# Altium project fNIRS_ECU.PrjPcb (part 1 of 3)
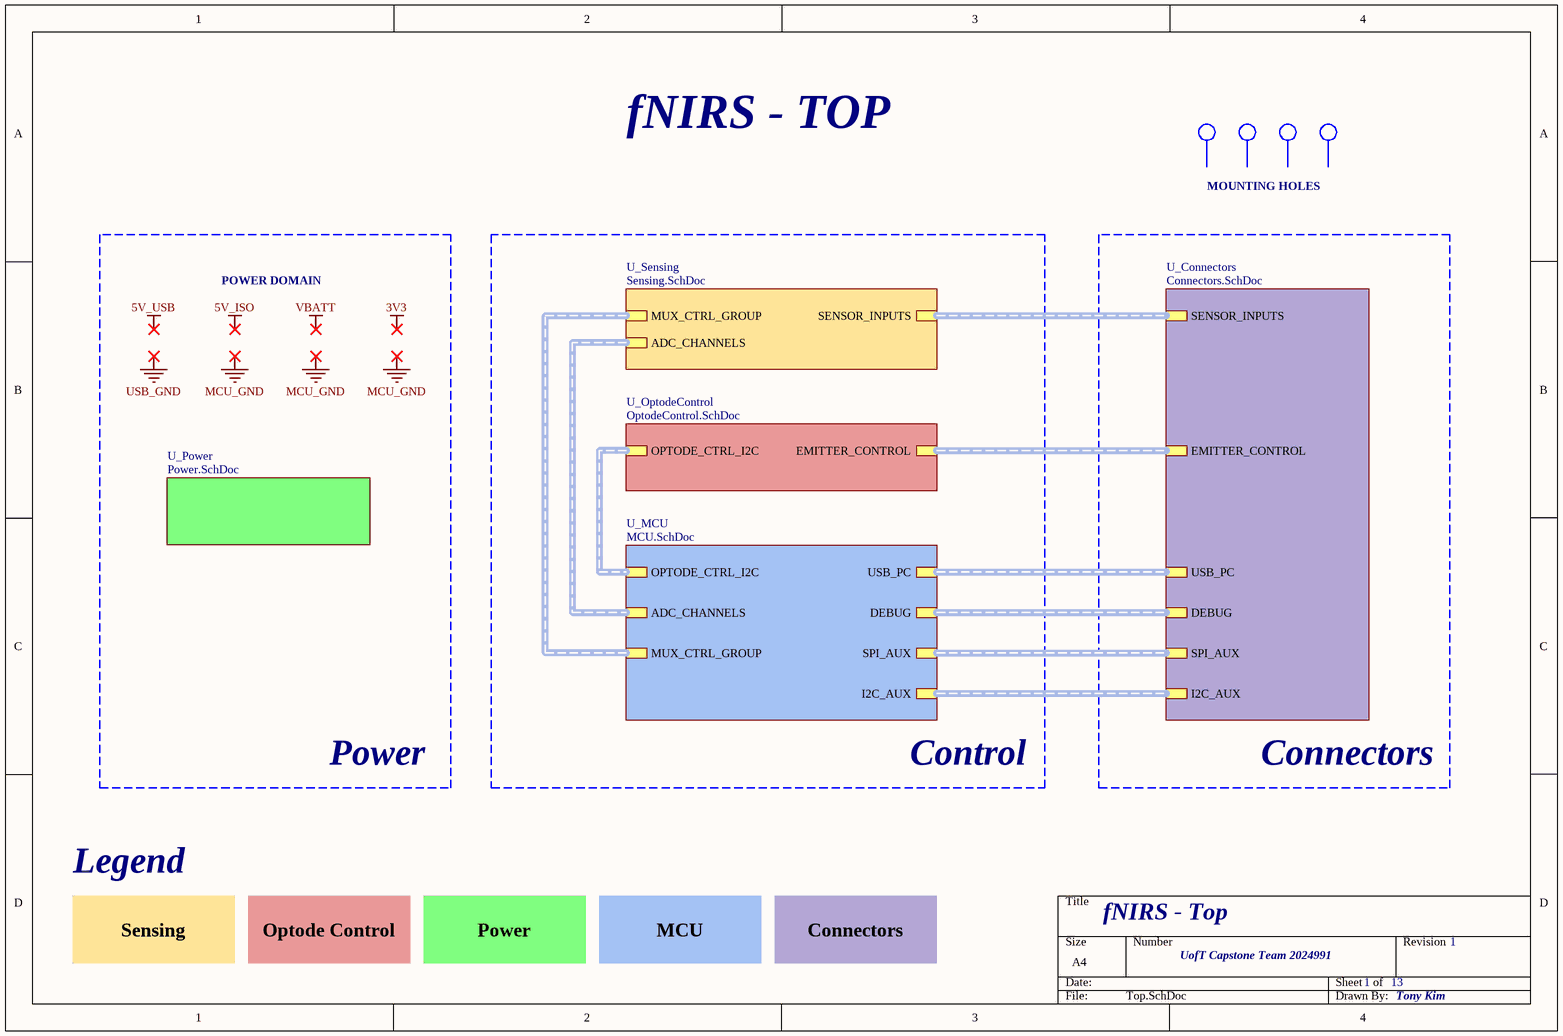
[diagram p0: Top.SchDoc]
13 sheets, 194 parts. Net scope: hierarchical (ports join the sheet entries above them; power ports are global).
Board file: fNIRS_PCB.PcbDoc
Sheets:
  Top.SchDoc
    U_OptodeControl = OptodeControl.SchDoc
    U_Sensing = Sensing.SchDoc
      U_AnalogMux = AnalogMux.SchDoc
      U_AnalogMux = AnalogMux.SchDoc
      U_AnalogMux = AnalogMux.SchDoc
      U_AnalogMux = AnalogMux.SchDoc
      U_AnalogMux = AnalogMux.SchDoc
      U_AnalogMux = AnalogMux.SchDoc
      U_AnalogMux = AnalogMux.SchDoc
      U_AnalogMux = AnalogMux.SchDoc
      U_Buffer = Buffer.SchDoc
      U_Buffer = Buffer.SchDoc
      U_Buffer = Buffer.SchDoc
      U_TemperatureSense = TemperatureSense.SchDoc
    U_Power = Power.SchDoc
    U_MCU = MCU.SchDoc
      U_GPIO_Expander = GPIO_Expander.SchDoc
      U_GPIO_Expander = GPIO_Expander.SchDoc
      U_SD_Card = SD_Card.SchDoc
      U_USBInterface = USBInterface.SchDoc
    U_Connectors = Connectors.SchDoc
      U_OptodeConnectors = OptodeConnectors.SchDoc

## Sheet Top.SchDoc: fNIRS - Top
size A4; CompanyName: UofT Capstone Team 2024991; DrawnBy: Tony Kim; Revision: 1; SheetNumber: 1; SheetTotal: 13

### Parts
MH1  M3 Mounting Hole  [New footprint 1]  (value not drawn)
MH2  M3 Mounting Hole  [New footprint 1]  (value not drawn)
MH3  M3 Mounting Hole  [New footprint 1]  (value not drawn)
MH4  M3 Mounting Hole  [New footprint 1]  (value not drawn)

### Sub-sheets
U_Connectors = Connectors.SchDoc: USB_PC (harness USB_PC), EMITTER_CONTROL (harness EMITTER_CONTROL), SENSOR_INPUTS (harness SENSOR_INPUTS), DEBUG (harness DEBUG), SPI_AUX (harness SPI_AUX), I2C_AUX (harness SPI_AUX)
U_MCU = MCU.SchDoc: ADC_CHANNELS (harness ADC_CHANNELS), DEBUG (harness DEBUG), OPTODE_CTRL_I2C (harness OPTODE_CTRL_I2C), MUX_CTRL_GROUP (harness MUX_SEL_GPIOS), SPI_AUX (harness SPI_AUX), USB_PC (harness USB_PC), I2C_AUX (harness SPI_AUX)
U_OptodeControl = OptodeControl.SchDoc: EMITTER_CONTROL (harness EMITTER_CONTROL), OPTODE_CTRL_I2C (harness OPTODE_CTRL_I2C)
U_Power = Power.SchDoc: no entries
U_Sensing = Sensing.SchDoc: SENSOR_INPUTS (harness SENSOR_INPUTS), MUX_CTRL_GROUP (harness MUX_CTRL_GROUP), ADC_CHANNELS (harness ADC_CHANNELS)

### Buses and harness runs
harness sheet U_Connectors/DEBUG = sheet U_MCU/DEBUG
harness sheet U_Connectors/EMITTER_CONTROL = sheet U_OptodeControl/EMITTER_CONTROL
harness sheet U_Connectors/I2C_AUX = sheet U_MCU/I2C_AUX
harness sheet U_Connectors/SENSOR_INPUTS = sheet U_Sensing/SENSOR_INPUTS
harness sheet U_Connectors/SPI_AUX = sheet U_MCU/SPI_AUX
harness sheet U_Connectors/USB_PC = sheet U_MCU/USB_PC
harness sheet U_MCU/ADC_CHANNELS = sheet U_Sensing/ADC_CHANNELS
harness sheet U_MCU/MUX_CTRL_GROUP = sheet U_Sensing/MUX_CTRL_GROUP
harness sheet U_MCU/OPTODE_CTRL_I2C = sheet U_OptodeControl/OPTODE_CTRL_I2C

### Notes on the sheet
- fNIRS - TOP
- MOUNTING HOLES
- POWER DOMAIN
- Power
- Control
- Connectors
- Legend
- Sensing
- Optode Control
- MCU
- Labels drawn without touching a wire or pin: 3V3, 5V_ISO, 5V_USB, MCU_GND, USB_GND, VBATT

### Library data of the parts
MH1-MH4 = CMP-004-0008-2

## Sheet OptodeControl.SchDoc: fNIRS - Optode Control
size A4; CompanyName: UofT Capstone Team 2024991; DrawnBy: Tony Kim; Revision: 1; SheetNumber: 7; SheetTotal: 13
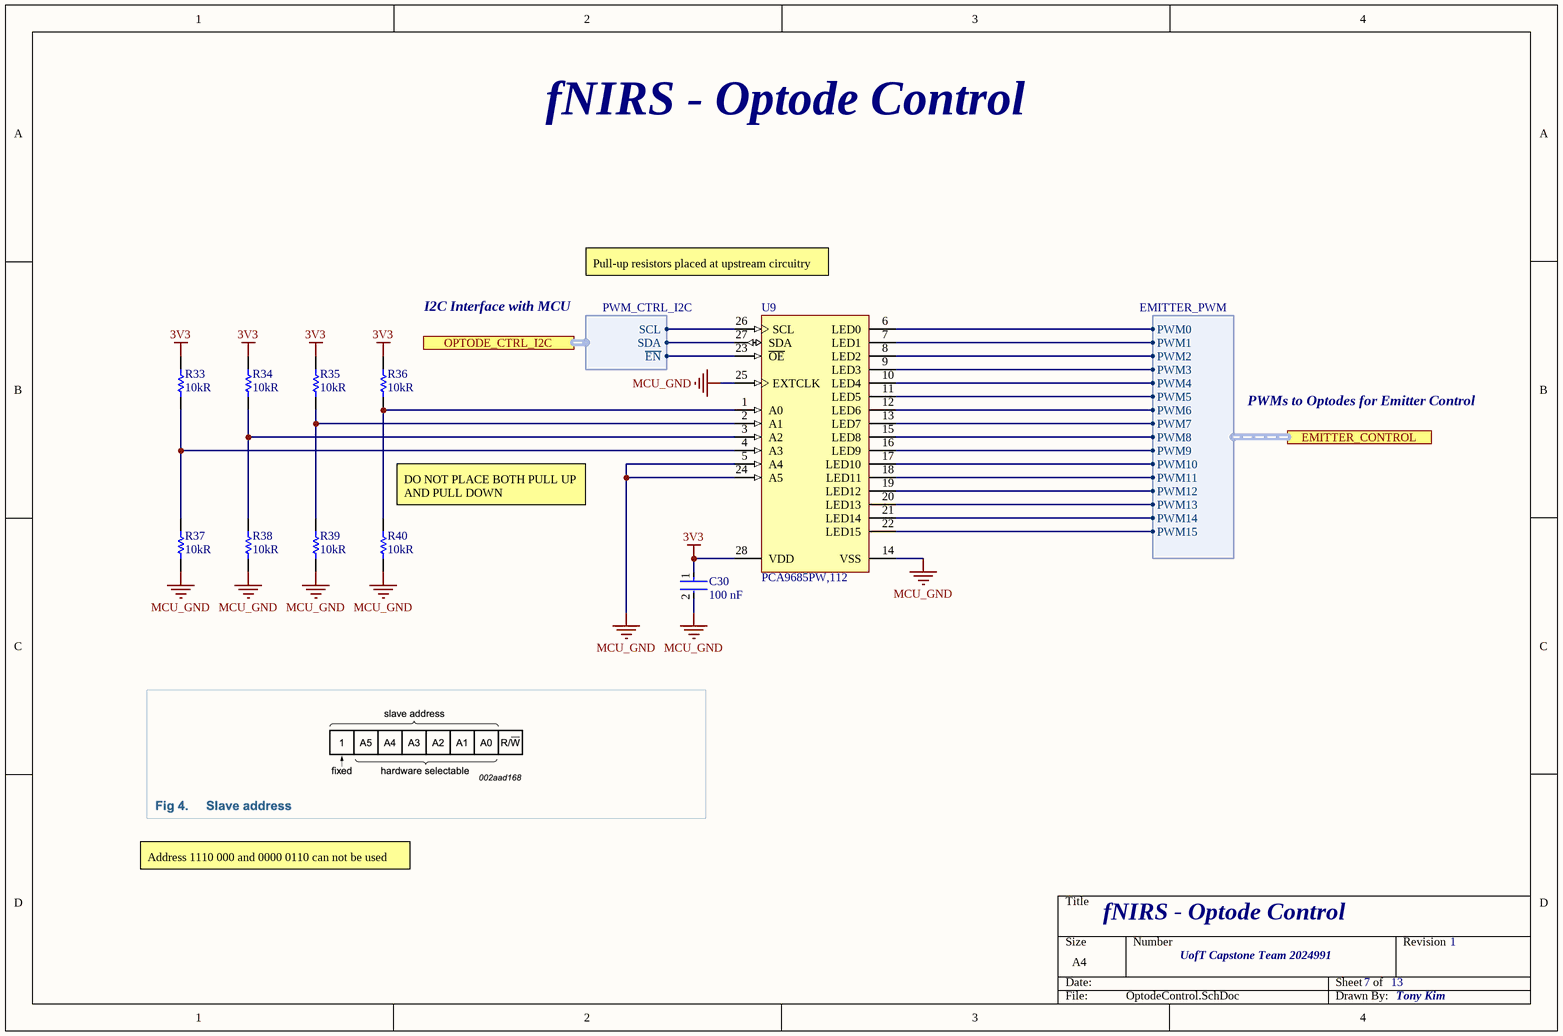
[diagram p1: OptodeControl.SchDoc]

### Parts
C30  Capacitance: 100 nF  [FP-CC0603-DA-MFG]  (hidden comment: CC0603KRX7R7BB104)
R33  Resistance: 10kR  [RESC1609X50X30NL8T20]  (hidden comment: CRCW060310K0FKEA)  (no BOM)
R34  Resistance: 10kR  [RESC1609X50X30NL8T20]  (hidden comment: CRCW060310K0FKEA)  (no BOM)
R35  Resistance: 10kR  [RESC1609X50X30NL8T20]  (hidden comment: CRCW060310K0FKEA)  (no BOM)
R36  Resistance: 10kR  [RESC1609X50X30NL8T20]  (hidden comment: CRCW060310K0FKEA)  (no BOM)
R37  Resistance: 10kR  [RESC1609X50X30NL8T20]  (hidden comment: CRCW060310K0FKEA)  (no BOM)
R38  Resistance: 10kR  [RESC1609X50X30NL8T20]  (hidden comment: CRCW060310K0FKEA)  (no BOM)
R39  Resistance: 10kR  [RESC1609X50X30NL8T20]  (hidden comment: CRCW060310K0FKEA)  (no BOM)
R40  Resistance: 10kR  [RESC1609X50X30NL8T20]  (hidden comment: CRCW060310K0FKEA)  (no BOM)
U9  PCA9685PW,112  [SOT361-1_V]

### Ports
EMITTER_CONTROL (harness EMITTER_PWM, see Top[3B], Connectors[7B]), OPTODE_CTRL_I2C (harness PWM_CTRL_I2C, see Top[2B], MCU[8C])

### Harnesses
PWM_CTRL_I2C: SCL, SDA, ~{EN}
EMITTER_PWM: PWM0, PWM1, PWM2, PWM3, PWM4, PWM5, PWM6, PWM7, PWM8, PWM9, PWM10, PWM11, PWM12, PWM13, PWM14, PWM15

### Nets
3V3: C30.1 R33.2 R34.2 R35.2 R36.2 U9.28(VDD)
MCU_GND: C30.2 R37.1 R38.1 R39.1 R40.1 U9.5(A4) U9.14(VSS) U9.24(A5) U9.25(EXTCLK)
I2C2_SCL: U9.26(SCL) ; port OPTODE_CTRL_I2C.SCL
I2C2_SDA: U9.27(SDA) ; port OPTODE_CTRL_I2C.SDA
PWM0: U9.6(LED0) ; port EMITTER_CONTROL.PWM0
PWM1: U9.7(LED1) ; port EMITTER_CONTROL.PWM1
PWM2: U9.8(LED2) ; port EMITTER_CONTROL.PWM2
PWM3: U9.9(LED3) ; port EMITTER_CONTROL.PWM3
PWM4: U9.10(LED4) ; port EMITTER_CONTROL.PWM4
PWM5: U9.11(LED5) ; port EMITTER_CONTROL.PWM5
PWM6: U9.12(LED6) ; port EMITTER_CONTROL.PWM6
PWM7: U9.13(LED7) ; port EMITTER_CONTROL.PWM7
PWM8: U9.15(LED8) ; port EMITTER_CONTROL.PWM8
PWM9: U9.16(LED9) ; port EMITTER_CONTROL.PWM9
PWM10: U9.17(LED10) ; port EMITTER_CONTROL.PWM10
PWM11: U9.18(LED11) ; port EMITTER_CONTROL.PWM11
PWM12: U9.19(LED12) ; port EMITTER_CONTROL.PWM12
PWM13: U9.20(LED13) ; port EMITTER_CONTROL.PWM13
PWM14: U9.21(LED14) ; port EMITTER_CONTROL.PWM14
PWM15: U9.22(LED15) ; port EMITTER_CONTROL.PWM15
PWM_CTRL_EN1: U9.23(~{OE}) ; port OPTODE_CTRL_I2C.~{EN}
NetR33_1: R33.1 R37.2 U9.4(A3)
NetR34_1: R34.1 R38.2 U9.3(A2)
NetR35_1: R35.1 R39.2 U9.2(A1)
NetR36_1: R36.1 R40.2 U9.1(A0)

### Notes on the sheet
- fNIRS - Optode Control
- I2C Interface with MCU
- Pull-up resistors placed at upstream circuitry
- PWMs to Optodes for Emitter Control
- (near R40) DO NOT PLACE BOTH PULL UP AND PULL DOWN
- Address 1110 000 and 0000 0110 can not be used

### Library data of the parts
C30 = CMP-2000-05002-2: CAP CER 0.1UF 16V X7R 0603; Manufacturer: YAGEO; Tolerance: 0.1; Value: 100 nF; Temperature Coefficient: 15%; Material: Ceramic; Voltage Rating: 16 V; Package: CC0603-DA; ComponentLink2Description: Datasheet; Octopart: https://octopart.com/cc0603krx7r7bb104-yageo-192941; Temperature Range High: +125°C; Digikey Description: CAP CER 0.1UF 16V X7R 0603; Voltage: 16 V; Device Class L2: Capacitors; Height: 0.9mm; Temperature: -55°C to +125°C; Manufacturer Part Number: CC0603KRX7R7BB104; Device Class L1: Passive Components; Device Class L3: Ceramic Capacitors; ComponentLink2URL: http://www.yageo.com/documents/recent/UPY-GPHC_X7R_6.3V-to-50V_18.pdf; Footprint Url: http://www.yageo.com/exep/pages/download/literatures/UPY-C_GEN_24.pdf; RoHS: TRUE; Temperature Range Low: -55°C; Temperature Characteristic: X7R; Lead Free: Yes; Category: Cap; Mouser Description: Multilayer Ceramic Capacitor, CC Series, 0.1 - F, - 10%, X7R, 16 V, 0603 [1608 Metric]; Automotive: No
R33-R40 = CMP-1666-00005-4: Chip Resistor, 10 KOhm, +/- 1%, 100 mW, -55 to 155 degC, 0603 (1608 Metric), RoHS, Tape and Reel; Manufacturer: Vishay Semiconductor; Voltage Rating: 75 V; Max Operating Temperature: 155 degC; PackageDescription: 2-Pin Surface Mount Device, Body 1.575 x 0.85 mm; ComponentLink1Description: Manufacturer URL; RoHSCompliant: true; PackageReference: 0603; REACH SVHC: Unknown; Length: 1.55 mm; DatasheetVersion: 06/2012; Packaging: Tape and Reel; Min Operating Temperature: -55 degC; Mounting Technology: Surface Mount; ComponentLink2URL: https://datasheet.ciiva.com/11809/0900766b80d98afc-11809037.pdf; Height: 0.45 mm; ComponentLink2Description: Datasheet; Package Quantity: 5000; ComponentLink1URL: http://www.vishay.com/
U9 = CMP-1595-00004-2: 16-Channel, 12-Bit PWM Fm+ I2C-Bus LED Controller, 2.3 to 5.5 V, -40 to 85 degC, 28-Pin TSSOP (SOT361-1), RoHS, Tape and Reel; Supply Current Max: 10 mA; Supply Voltage Min: 2.3 V; Supply Voltage Max: 5.5 V; Frequency: 25000000 Hz; Temperature Min: -40 degC; PackageDescription: 28-Pin Small Outline Package, Body 9.7 x 4.4 mm, Pitch 0.65 mm; RoHS: TRUE; ComponentLink1Description: Manufacturer URL; Code_JEDEC: MO-153; PartNumber: PCA9685; ComponentLink2URL: http://www.nxp.com/documents/data_sheet/PCA9685.pdf; Packing: Tape and Reel; ComponentLink1URL: http://www.nxp.com/; ComponentLink3Description: Package Specification; ComponentLink2Description: Datasheet; ComponentLink3URL: http://www.nxp.com/documents/outline_drawing/sot361-1_po.pdf; DatasheetVersion: Rev. 4; Temperature Max: 85 degC; PackageVersion: 02/2003; Mounting Technology: Surface Mount

## Sheet Sensing.SchDoc: fNIRS - Sensing
size A3; CompanyName: UofT Capstone Team 2024991; DrawnBy: Tony Kim; Revision: 1; SheetNumber: 8; SheetTotal: 13
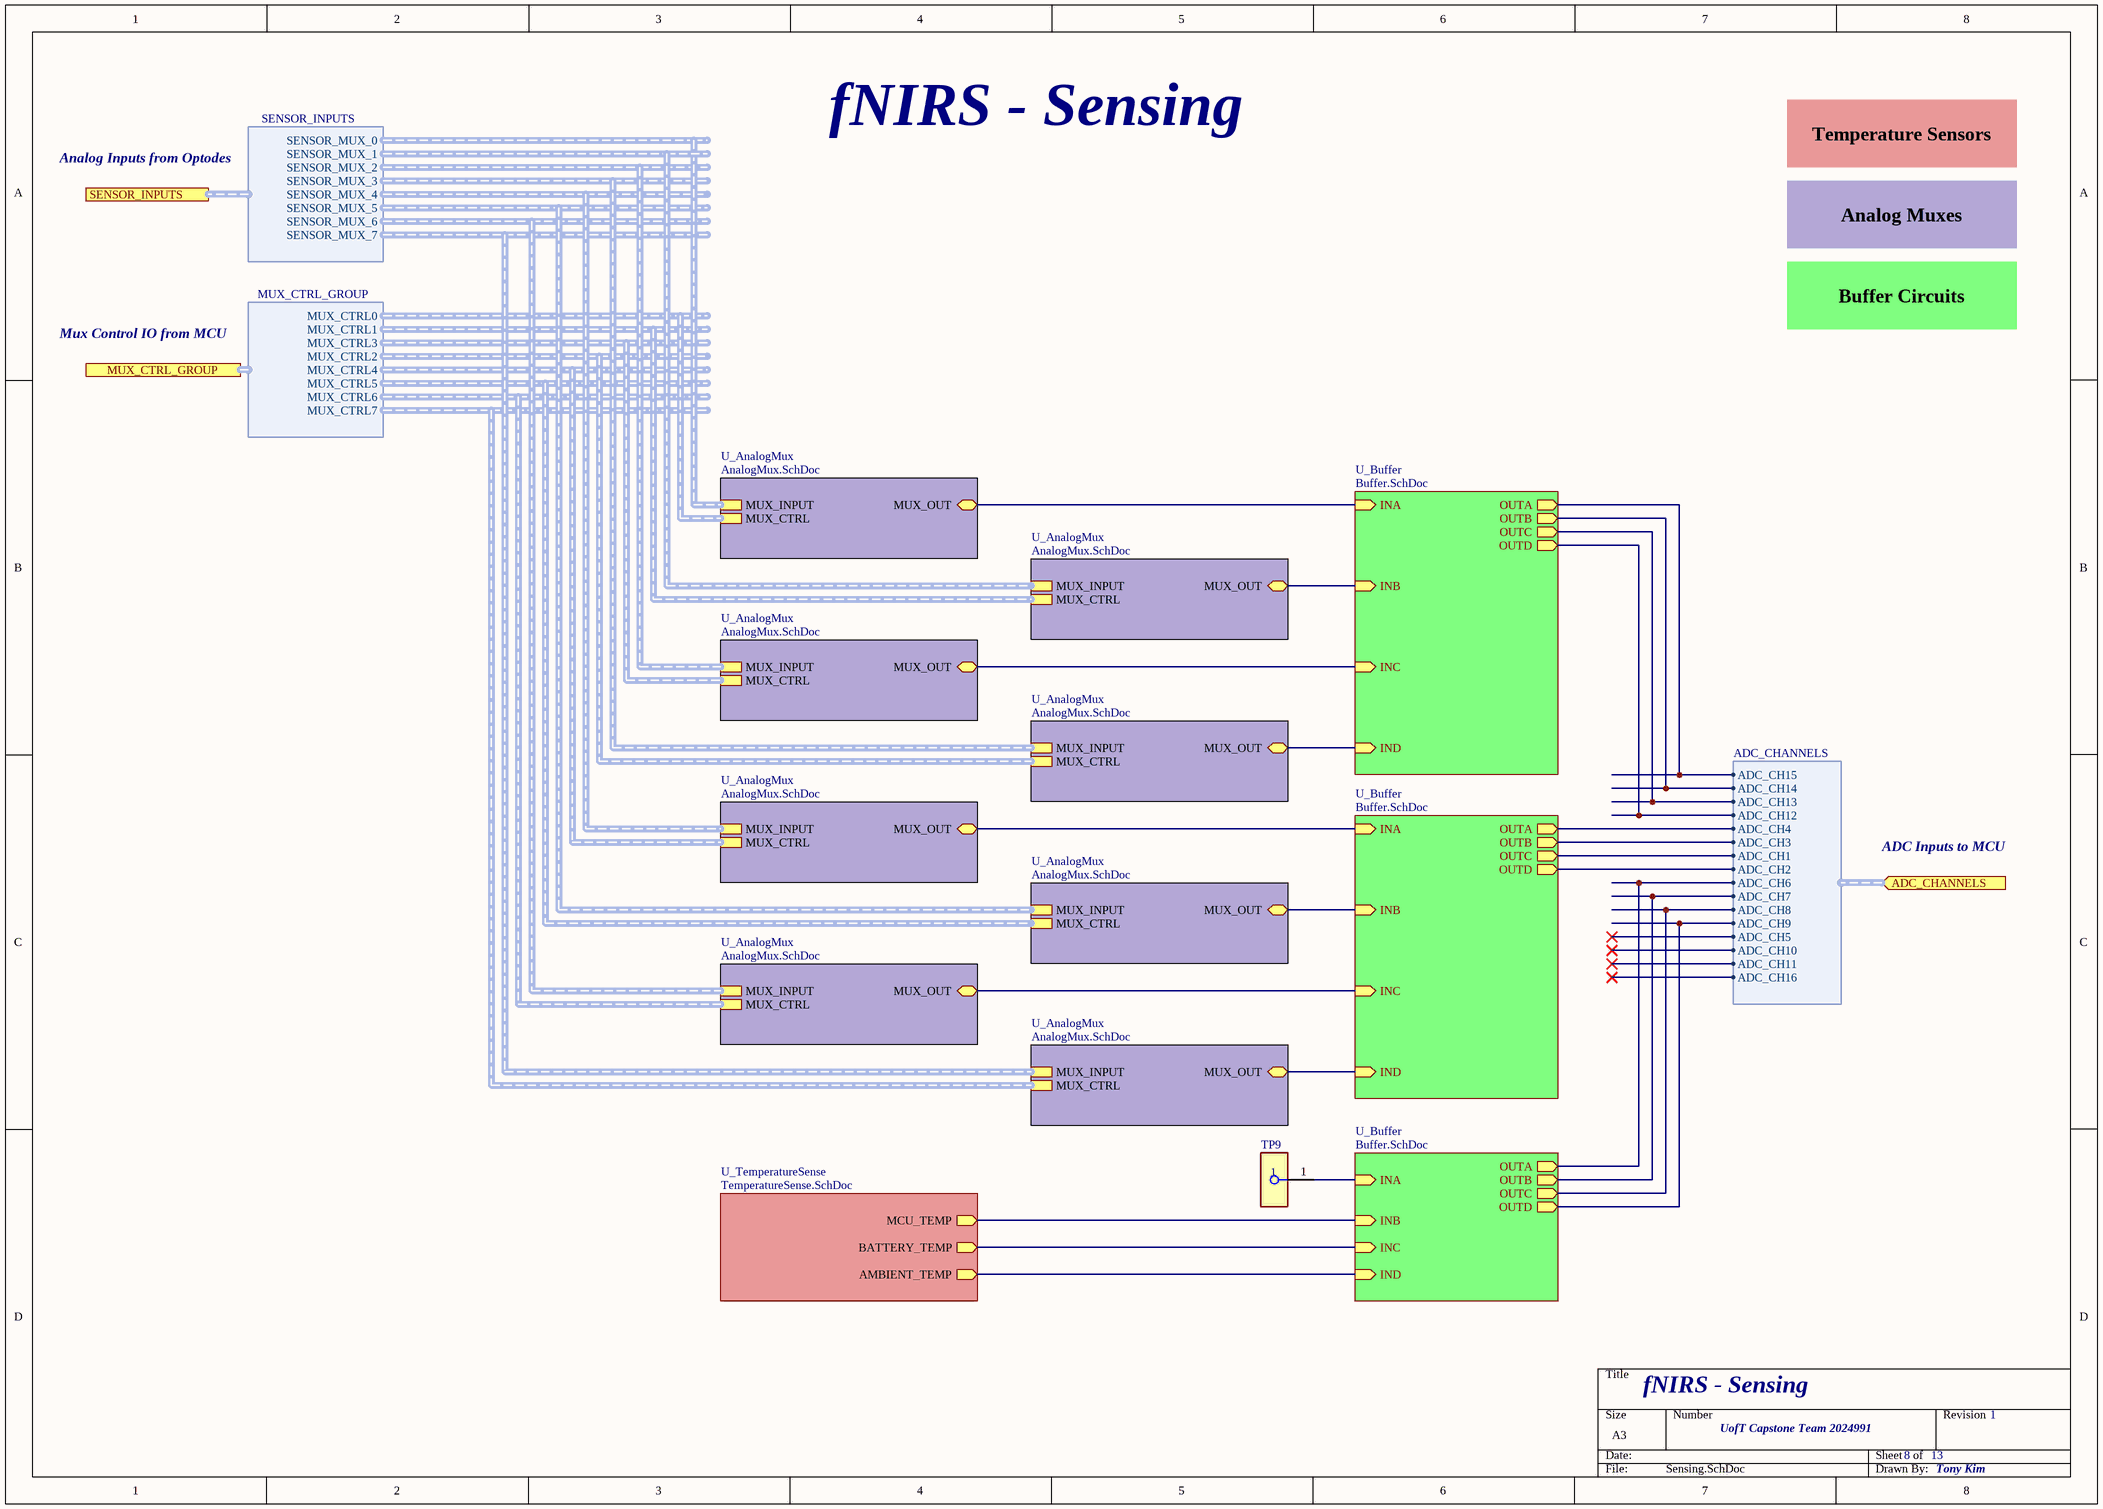
[diagram p2: Sensing.SchDoc]

### Parts
TP9  S2761-46R  [FP-S2761-46R-MFG]  (value not drawn)

### Sub-sheets
U_AnalogMux = AnalogMux.SchDoc: MUX_INPUT (harness SENSOR_INPUT), MUX_CTRL (harness MUX_CTRL), MUX_OUT (bidir)
U_AnalogMux = AnalogMux.SchDoc: MUX_INPUT (harness SENSOR_INPUT), MUX_CTRL (harness MUX_CTRL), MUX_OUT (bidir)
U_AnalogMux = AnalogMux.SchDoc: MUX_INPUT (harness SENSOR_INPUT), MUX_CTRL (harness MUX_CTRL), MUX_OUT (bidir)
U_AnalogMux = AnalogMux.SchDoc: MUX_INPUT (harness SENSOR_INPUT), MUX_CTRL (harness MUX_CTRL), MUX_OUT (bidir)
U_AnalogMux = AnalogMux.SchDoc: MUX_INPUT (harness SENSOR_INPUT), MUX_CTRL (harness MUX_CTRL), MUX_OUT (bidir)
U_AnalogMux = AnalogMux.SchDoc: MUX_INPUT (harness SENSOR_INPUT), MUX_CTRL (harness MUX_CTRL), MUX_OUT (bidir)
U_AnalogMux = AnalogMux.SchDoc: MUX_INPUT (harness SENSOR_INPUT), MUX_CTRL (harness MUX_CTRL), MUX_OUT (bidir)
U_AnalogMux = AnalogMux.SchDoc: MUX_INPUT (harness SENSOR_INPUT), MUX_CTRL (harness MUX_CTRL), MUX_OUT (bidir)
U_Buffer = Buffer.SchDoc: OUTA (out), OUTB (out), OUTC (out), OUTD (out), INA (in), INB (in), INC (in), IND (in)
U_Buffer = Buffer.SchDoc: OUTA (out), OUTB (out), OUTC (out), OUTD (out), INA (in), INB (in), INC (in), IND (in)
U_Buffer = Buffer.SchDoc: OUTA (out), OUTB (out), OUTC (out), OUTD (out), INA (in), INB (in), INC (in), IND (in)
U_TemperatureSense = TemperatureSense.SchDoc: MCU_TEMP (out), AMBIENT_TEMP (out), BATTERY_TEMP (out)

### Ports
ADC_CHANNELS (in, harness ADC_CHANNELS, see Top[2B], MCU[1C]), MUX_CTRL_GROUP (harness MUX_CTRL_GROUP, see Top[2B], MCU[8B]), SENSOR_INPUTS (harness SENSOR_INPUTS, see Top[3B], Connectors[1B])

### Harnesses
SENSOR_INPUTS: SENSOR_MUX_0, SENSOR_MUX_1, SENSOR_MUX_2, SENSOR_MUX_3, SENSOR_MUX_4, SENSOR_MUX_5, SENSOR_MUX_6, SENSOR_MUX_7
MUX_CTRL_GROUP: MUX_CTRL0, MUX_CTRL1, MUX_CTRL3, MUX_CTRL2, MUX_CTRL4, MUX_CTRL5, MUX_CTRL6, MUX_CTRL7
ADC_CHANNELS: ADC_CH1, ADC_CH2, ADC_CH3, ADC_CH4, ADC_CH5, ADC_CH6, ADC_CH7, ADC_CH8, ADC_CH9, ADC_CH10, ADC_CH11, ADC_CH12, ADC_CH13, ADC_CH14, ADC_CH15, ADC_CH16

### Nets
ADC12_IN6: sheet U_Buffer/OUTA, port ADC_CHANNELS.ADC_CH6
ADC12_IN7: sheet U_Buffer/OUTB, port ADC_CHANNELS.ADC_CH7
ADC12_IN8: sheet U_Buffer/OUTC, port ADC_CHANNELS.ADC_CH8
ADC12_IN9: sheet U_Buffer/OUTD, port ADC_CHANNELS.ADC_CH9
ADC12_IN12: sheet U_Buffer/OUTD, port ADC_CHANNELS.ADC_CH12
ADC12_IN13: sheet U_Buffer/OUTC, port ADC_CHANNELS.ADC_CH13
ADC12_IN14: sheet U_Buffer/OUTB, port ADC_CHANNELS.ADC_CH14
ADC12_IN15: sheet U_Buffer/OUTA, port ADC_CHANNELS.ADC_CH15
ADC123_IN1: sheet U_Buffer/OUTC, port ADC_CHANNELS.ADC_CH1
ADC123_IN2: sheet U_Buffer/OUTD, port ADC_CHANNELS.ADC_CH2
ADC123_IN3: sheet U_Buffer/OUTB, port ADC_CHANNELS.ADC_CH3
ADC123_IN4: sheet U_Buffer/OUTA, port ADC_CHANNELS.ADC_CH4
AMBIENT_TEMP: sheet U_Buffer/IND, sheet U_TemperatureSense/AMBIENT_TEMP
BATTERY_TEMP: sheet U_Buffer/INC, sheet U_TemperatureSense/BATTERY_TEMP
INA: TP9.1 ; sheet U_Buffer/INA
INA: sheet U_AnalogMux/MUX_OUT, sheet U_Buffer/INA  [a separate net that carries the same name]
INA: sheet U_AnalogMux/MUX_OUT, sheet U_Buffer/INA  [a separate net that carries the same name]
INB: sheet U_AnalogMux/MUX_OUT, sheet U_Buffer/INB
INB: sheet U_AnalogMux/MUX_OUT, sheet U_Buffer/INB  [a separate net that carries the same name]
INB: sheet U_Buffer/INB, sheet U_TemperatureSense/MCU_TEMP  [a separate net that carries the same name]
INC: sheet U_AnalogMux/MUX_OUT, sheet U_Buffer/INC
INC: sheet U_AnalogMux/MUX_OUT, sheet U_Buffer/INC  [a separate net that carries the same name]
IND: sheet U_AnalogMux/MUX_OUT, sheet U_Buffer/IND
IND: sheet U_AnalogMux/MUX_OUT, sheet U_Buffer/IND  [a separate net that carries the same name]

### Notes on the sheet
- Analog Inputs from Optodes
- fNIRS - Sensing
- Temperature Sensors
- Analog Muxes
- Mux Control IO from MCU
- Buffer Circuits
- ADC Inputs to MCU

### Library data of the parts
TP9 = CMP-15817-000011-1: PC TEST POINT NATURAL; Body Material: Brass; Plating: Tin; Material: Copper Alloy; Mount: Surface Mount; Color: Natural; Packaging: Tape and Reel; RoHS Compliant: Yes

## Sheet AnalogMux.SchDoc: fNIRS - Analog Mux
size A4; CompanyName: UofT Capstone Team 2024991; DrawnBy: Tony Kim; Engineer: Tony Kim; Revision: 1; SheetNumber: 9; SheetTotal: 13
Used 8 times, as channels U_Sensing/U_AnalogMux, U_Sensing/U_AnalogMux, U_Sensing/U_AnalogMux, U_Sensing/U_AnalogMux, U_Sensing/U_AnalogMux, U_Sensing/U_AnalogMux, U_Sensing/U_AnalogMux, U_Sensing/U_AnalogMux. Parts and nets are listed once, with the designators drawn on the sheet.
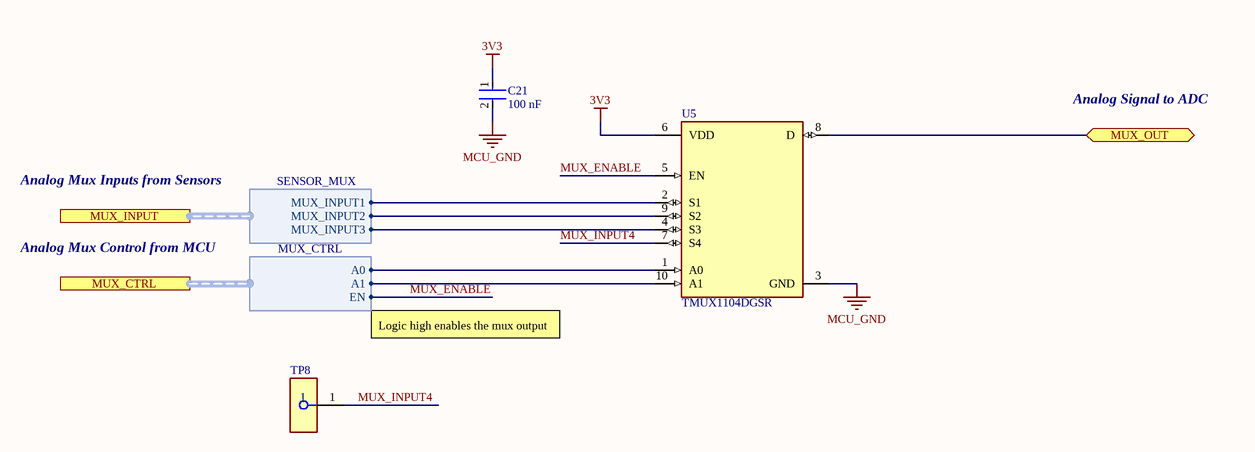
[diagram p3: AnalogMux.SchDoc]

### Parts
C21  Capacitance: 100 nF  [FP-CC0603-DA-MFG]  (hidden comment: CC0603KRX7R7BB104)
TP8  S2761-46R  [FP-S2761-46R-MFG]  (value not drawn)
U5  TMUX1104DGSR  [FP-DGS0010A-MFG]

### Ports
MUX_CTRL (harness MUX_CTRL, see Sensing[3B]), MUX_INPUT (harness SENSOR_MUX, see Sensing[3B]), MUX_OUT (bidir, see Sensing[4B])

### Harnesses
SENSOR_MUX: MUX_INPUT1, MUX_INPUT2, MUX_INPUT3
MUX_CTRL: A0, A1, EN

### Nets
3V3: C21.1 U5.6(VDD)
MCU_GND: C21.2 U5.3(GND)
MUX_ENABLE: U5.5(EN) ; port MUX_CTRL.EN
MUX_INPUT4: TP8.1 U5.7(S4)
MUX_OUT: U5.8(D) ; port MUX_OUT
NetU5_1: U5.1(A0) ; port MUX_CTRL.A0
NetU5_2: U5.2(S1) ; port MUX_INPUT.MUX_INPUT1
NetU5_4: U5.4(S3) ; port MUX_INPUT.MUX_INPUT3
NetU5_9: U5.9(S2) ; port MUX_INPUT.MUX_INPUT2
NetU5_10: U5.10(A1) ; port MUX_CTRL.A1

### Channels
U_Sensing/U_AnalogMux: designators end in _U_Sensing_U_AnalogMux#1; ports MUX_OUT=INA
U_Sensing/U_AnalogMux: designators end in _U_Sensing_U_AnalogMux#2; ports MUX_OUT=INC
U_Sensing/U_AnalogMux: designators end in _U_Sensing_U_AnalogMux#3; ports MUX_OUT=INA
U_Sensing/U_AnalogMux: designators end in _U_Sensing_U_AnalogMux#4; ports MUX_OUT=INC
U_Sensing/U_AnalogMux: designators end in _U_Sensing_U_AnalogMux#5; ports MUX_OUT=INB
U_Sensing/U_AnalogMux: designators end in _U_Sensing_U_AnalogMux#6; ports MUX_OUT=IND
U_Sensing/U_AnalogMux: designators end in _U_Sensing_U_AnalogMux#7; ports MUX_OUT=INB
U_Sensing/U_AnalogMux: designators end in _U_Sensing_U_AnalogMux#8; ports MUX_OUT=IND

### Notes on the sheet
- Analog Signal to ADC
- Analog Mux Inputs from Sensors
- Analog Mux Control from MCU
- Logic high enables the mux output

### Library data of the parts
C21 = CMP-2000-05002-2: as C30 on sheet OptodeControl; Voltage Rating: 16 V; Package: CC0603-DA; ComponentLink2Description: Datasheet; Octopart: https://octopart.com/cc0603krx7r7bb104-yageo-192941; Temperature Range High: +125°C; Digikey Description: CAP CER 0.1UF 16V X7R 0603; Voltage: 16 V; Device Class L2: Capacitors; Height: 0.9mm; Temperature: -55°C to +125°C; Manufacturer Part Number: CC0603KRX7R7BB104; Device Class L1: Passive Components; Device Class L3: Ceramic Capacitors; ComponentLink2URL: http://www.yageo.com/documents/recent/UPY-GPHC_X7R_6.3V-to-50V_18.pdf; Footprint Url: http://www.yageo.com/exep/pages/download/literatures/UPY-C_GEN_24.pdf; RoHS: TRUE; Temperature Range Low: -55°C; Temperature Characteristic: X7R; Lead Free: Yes; Category: Cap; Mouser Description: Multilayer Ceramic Capacitor, CC Series, 0.1 - F, - 10%, X7R, 16 V, 0603 [1608 Metric]; Automotive: No
TP8 = CMP-15817-000011-1: as TP9 on sheet Sensing; Material: Copper Alloy; Mount: Surface Mount; Color: Natural; Packaging: Tape and Reel; RoHS Compliant: Yes
U5 = CMP-04892-000031-2: IC SWITCH SINGLE 10VSSOP; RoHS Compliant: Yes

## Sheet Buffer.SchDoc: fNIRS - Buffer
size A4; CompanyName: UofT Capstone Team 2024991; DrawnBy: Tony Kim; Revision: 1; SheetNumber: 10; SheetTotal: 13
Used 3 times, as channels U_Sensing/U_Buffer, U_Sensing/U_Buffer, U_Sensing/U_Buffer. Parts and nets are listed once, with the designators drawn on the sheet.
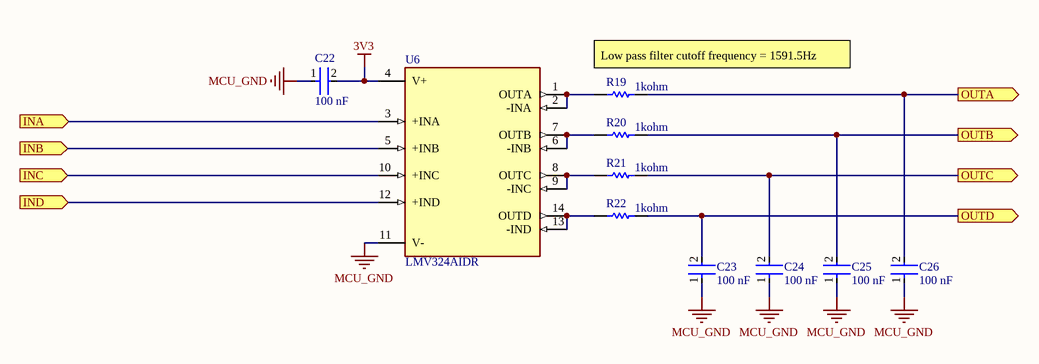
[diagram p4: Buffer.SchDoc]

### Parts
C22  Capacitance: 100 nF  [FP-CC0603-DA-MFG]  (hidden comment: CC0603KRX7R7BB104)
C23  Capacitance: 100 nF  [FP-CC0603-DA-MFG]  (hidden comment: CC0603KRX7R7BB104)
C24  Capacitance: 100 nF  [FP-CC0603-DA-MFG]  (hidden comment: CC0603KRX7R7BB104)
C25  Capacitance: 100 nF  [FP-CC0603-DA-MFG]  (hidden comment: CC0603KRX7R7BB104)
C26  Capacitance: 100 nF  [FP-CC0603-DA-MFG]  (hidden comment: CC0603KRX7R7BB104)
R19  Resistance: 1kohm  [RESC1608X55X25ML10T15]  (hidden comment: RC0603JR-071KL)
R20  Resistance: 1kohm  [RESC1608X55X25ML10T15]  (hidden comment: RC0603JR-071KL)
R21  Resistance: 1kohm  [RESC1608X55X25ML10T15]  (hidden comment: RC0603JR-071KL)
R22  Resistance: 1kohm  [RESC1608X55X25ML10T15]  (hidden comment: RC0603JR-071KL)
U6  LMV324AIDR  [SOIC127P600X175-14N]

### Ports
INA (in, see Sensing[6B]), INB (in, see Sensing[6B]), INC (in, see Sensing[6B]), IND (in, see Sensing[6B]), OUTA (out, see Sensing[6B]), OUTB (out, see Sensing[6B]), OUTC (out, see Sensing[6B]), OUTD (out, see Sensing[6B])

### Nets
3V3: C22.2 U6.4(V+)
MCU_GND: C22.1 C23.1 C24.1 C25.1 C26.1 U6.11(V-)
INA: U6.3(+INA) ; port INA
INB: U6.5(+INB) ; port INB
INC: U6.10(+INC) ; port INC
IND: U6.12(+IND) ; port IND
OUTA: C26.2 R19.2 ; port OUTA
OUTB: C25.2 R20.2 ; port OUTB
OUTC: C24.2 R21.2 ; port OUTC
OUTD: C23.2 R22.2 ; port OUTD
NetR19_1: R19.1 U6.1(OUTA) U6.2(-INA)
NetR20_1: R20.1 U6.6(-INB) U6.7(OUTB)
NetR21_1: R21.1 U6.8(OUTC) U6.9(-INC)
NetR22_1: R22.1 U6.13(-IND) U6.14(OUTD)

### Channels
U_Sensing/U_Buffer: designators end in _U_Sensing_U_Buffer#1; ports INA=INA INB=INB INC=INC IND=IND OUTA=ADC12_IN15 OUTB=ADC12_IN14 OUTC=ADC12_IN13 OUTD=ADC12_IN12
U_Sensing/U_Buffer: designators end in _U_Sensing_U_Buffer#2; ports INA=INA INB=INB INC=INC IND=IND OUTA=ADC123_IN4 OUTB=ADC123_IN3 OUTC=ADC123_IN1 OUTD=ADC123_IN2
U_Sensing/U_Buffer: designators end in _U_Sensing_U_Buffer#3; ports INA=INA INB=INB INC=BATTERY_TEMP IND=AMBIENT_TEMP OUTA=ADC12_IN6 OUTB=ADC12_IN7 OUTC=ADC12_IN8 OUTD=ADC12_IN9

### Notes on the sheet
- (near R19) Low pass filter cutoff frequency = 1591.5Hz

### Library data of the parts
C22-C26 = CMP-2000-05002-2: as C30 on sheet OptodeControl; Voltage Rating: 16 V; Package: CC0603-DA; ComponentLink2Description: Datasheet; Octopart: https://octopart.com/cc0603krx7r7bb104-yageo-192941; Temperature Range High: +125°C; Digikey Description: CAP CER 0.1UF 16V X7R 0603; Voltage: 16 V; Device Class L2: Capacitors; Height: 0.9mm; Temperature: -55°C to +125°C; Manufacturer Part Number: CC0603KRX7R7BB104; Device Class L1: Passive Components; Device Class L3: Ceramic Capacitors; ComponentLink2URL: http://www.yageo.com/documents/recent/UPY-GPHC_X7R_6.3V-to-50V_18.pdf; Footprint Url: http://www.yageo.com/exep/pages/download/literatures/UPY-C_GEN_24.pdf; RoHS: TRUE; Temperature Range Low: -55°C; Temperature Characteristic: X7R; Lead Free: Yes; Category: Cap; Mouser Description: Multilayer Ceramic Capacitor, CC Series, 0.1 - F, - 10%, X7R, 16 V, 0603 [1608 Metric]; Automotive: No
R19-R22 = CMP-2000-05023-1: Chip Resistor, 1 KOhm, +/- 5%, 0.063 W, -55 to 155 degC, 0603 (1608 Metric), RoHS, Tape and Reel; Manufacturer: Yageo; Resistor Case Style: 0603[1608Metric]; Resistor Element Type: ThickFilm; Product Range: RCSeries; SVHC: ToBeAdvised; Voltage Rating: 50V; Temperature Coefficient: ±100ppm/degC; Power Rating: 100mW; Packaging: CutTape; Manufacturer URL: http://www.yageo.com/; Resistance Tolerance: ±5%; Datasheet Version: Rev. 4, 04/2009; MSL: MSL1-Unlimited; Package Description: 2-Pin Surface Mount Device, Body 1.6 x 0.8 mm; Automotive Qualification Standard: -; Package Reference: 603; Datasheet URL: https://datasheet.ciiva.com/2452/pyu-rc0603-51-rohs-l-4-2452848.pdf
U6 = LMV324AIDR: LMV324A, Quad Low-Voltage Rail-to-Rail Output Operational Amplifier 14-SOIC -40 to 125; MF: Texas Instruments; Package: SOIC-14 Texas Instruments; Price: None; MP: LMV324AIDR; Availability: Warning; Value: *; Texas_Instruments-Purchase-URL: https://snapeda.com/shop?store=Texas+Instruments&id=3658521; Mouser-Purchase-URL: https://snapeda.com/shop?store=Mouser&id=3658521; SnapEDA_Link: https://www.snapeda.com/parts/LMV324AIDR/Texas%20Instruments/view-part/3658521/?ref=snap

## Sheet TemperatureSense.SchDoc: fNIRS - Temperature Sense
size A4; CompanyName: UofT Capstone Team 2024991; DrawnBy: Tony Kim; Revision: 1; SheetNumber: 11; SheetTotal: 13
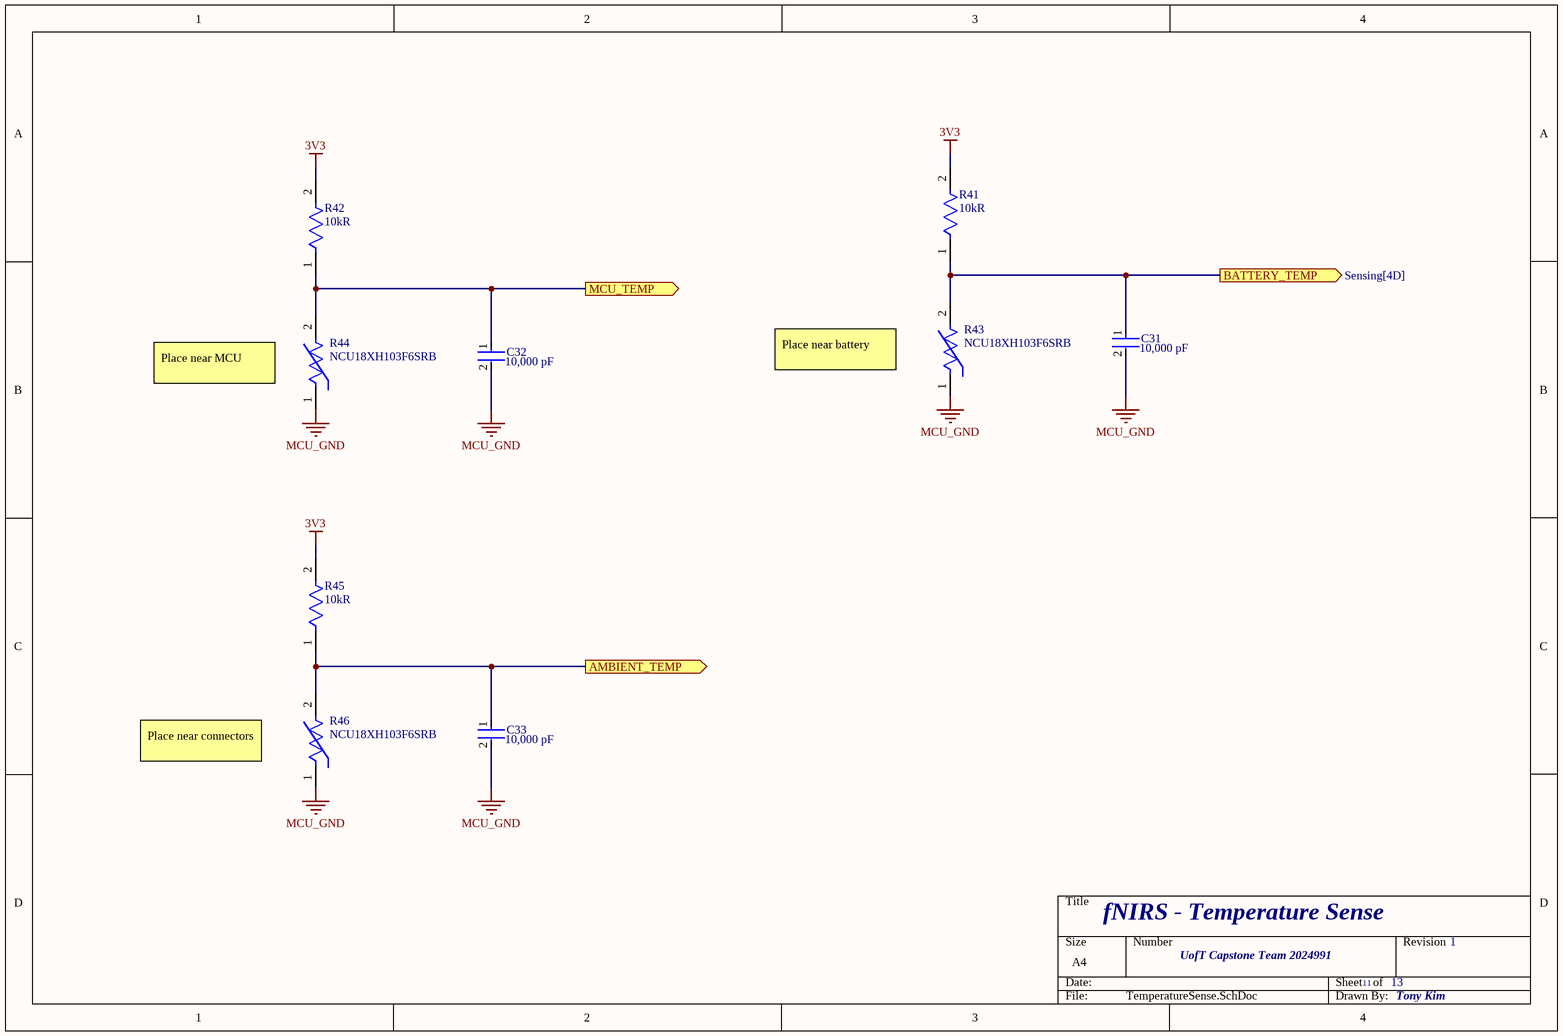
[diagram p5: TemperatureSense.SchDoc]

### Parts
C31  Capacitance: 10,000 pF  [FP-C0603C-CF-MFG]  (hidden comment: C0603C103K2RACTU)
C32  Capacitance: 10,000 pF  [FP-C0603C-CF-MFG]  (hidden comment: C0603C103K2RACTU)
C33  Capacitance: 10,000 pF  [FP-C0603C-CF-MFG]  (hidden comment: C0603C103K2RACTU)
R41  Resistance: 10kR  [FP-CRCW0603-e3-IPC_B]  (hidden comment: CRCW060310K0FKEB)
R42  Resistance: 10kR  [FP-CRCW0603-e3-IPC_B]  (hidden comment: CRCW060310K0FKEB)
R43  NCU18XH103F6SRB  [FP-NCU18-0_15-IPC_B]
R44  NCU18XH103F6SRB  [FP-NCU18-0_15-IPC_B]
R45  Resistance: 10kR  [FP-CRCW0603-e3-IPC_B]  (hidden comment: CRCW060310K0FKEB)
R46  NCU18XH103F6SRB  [FP-NCU18-0_15-IPC_B]

### Ports
AMBIENT_TEMP (out, see Sensing[4D]), BATTERY_TEMP (out, see Sensing[4D]), MCU_TEMP (out, see Sensing[4D])

### Nets
3V3: R41.2 R42.2 R45.2
MCU_GND: C31.2 C32.2 C33.2 R43.1 R44.1 R46.1
AMBIENT_TEMP: C33.1 R45.1 R46.2 ; port AMBIENT_TEMP
BATTERY_TEMP: C31.1 R41.1 R43.2 ; port BATTERY_TEMP
INB: C32.1 R42.1 R44.2 ; port MCU_TEMP

### Notes on the sheet
- (near R44) Place near MCU
- Place near battery
- Place near connectors

### Library data of the parts
C31-C33 = CMP-2006-03038-2: CAP CER 10000PF 200V X7R 0603; Manufacturer: KEMET; Material: Ceramic; Value: 10,000 pF; Temperature Coefficient: 30ppm/°C; Tolerance: 0.1; Automotive Grade: Grade 1; Voltage Rating: 200 V; Manufacturer Part Number: C0603C103K2RACTU; ComponentLink2Description: Datasheet; Package: C0603C-CF; Device Class L2: Capacitors; Mouser Description: Multilayer Ceramic Capacitors MLCC - SMD/SMT 200volts 10000pF X7R 10%; Device Class L3: Ceramic Capacitors; Temperature Range Low: -55°C; Category: Cap; Device Class L1: Passive Components; Lead Free: Yes; Octopart: https://octopart.com/c0603c103k2ractu-kemet-1061947; ComponentLink2URL: https://api.kemet.com/component-edge/download/datasheet/C0603C100J5GACAUTO.pdf; Temperature Characteristic: X7R; Temperature: -55°C to +125°C; Automotive: Yes; Temperature Range High: +125°C; Digikey Description: CAP CER 10000PF 200V X7R 0603; Height: 0.87mm; RoHS: TRUE
R41 R42 R45 = CMP-2000-03836-2: RES Thick Film, 10kΩ, 1%, 0.1W, 100ppm/°C, 0603; Voltage Rating: 75V; Max Power Dissipation: 100mW; Min Operating Temperature: -55°C; Packaging: Tape and Reel; Temperature Coefficient: 100ppm/°C; Case/Package: 0603; Max Operating Temperature: 155°C; Package Quantity: 10000; Voltage Rating (DC): 75V; Depth: 0.85mm; Case Code (Imperial): 0603; Power Rating: 100mW; Military Standard: Not; Height: 0.02inch; Weight: 7.1E-05oz; Number of Pins: 2; Width: 0.033inch; Number of Terminations: 2; Contact Plating: Tin; Length: 1.55mm; Features: Automotive AEC-Q200; Lead Free: Lead Free; Tolerance: 1%; Composition: Thick Film; Radiation Hardening: No; Case Code (Metric): 1608
R43 R44 R46 = CMP-06022-000547-2: THERMISTOR NTC; Min Operating Temperature: -40°C; Case Code (Metric): 1608; Max Operating Temperature: 150°C; RoHS Compliant: Yes; Case/Package: 0603; Case Code (Imperial): 0603; REACH SVHC: No SVHC

## Sheet Power.SchDoc: fNIRS - Power
size A4; CompanyName: UofT Capstone Team 2024991; DrawnBy: Tony Kim; Revision: 1; SheetNumber: 2; SheetTotal: 13
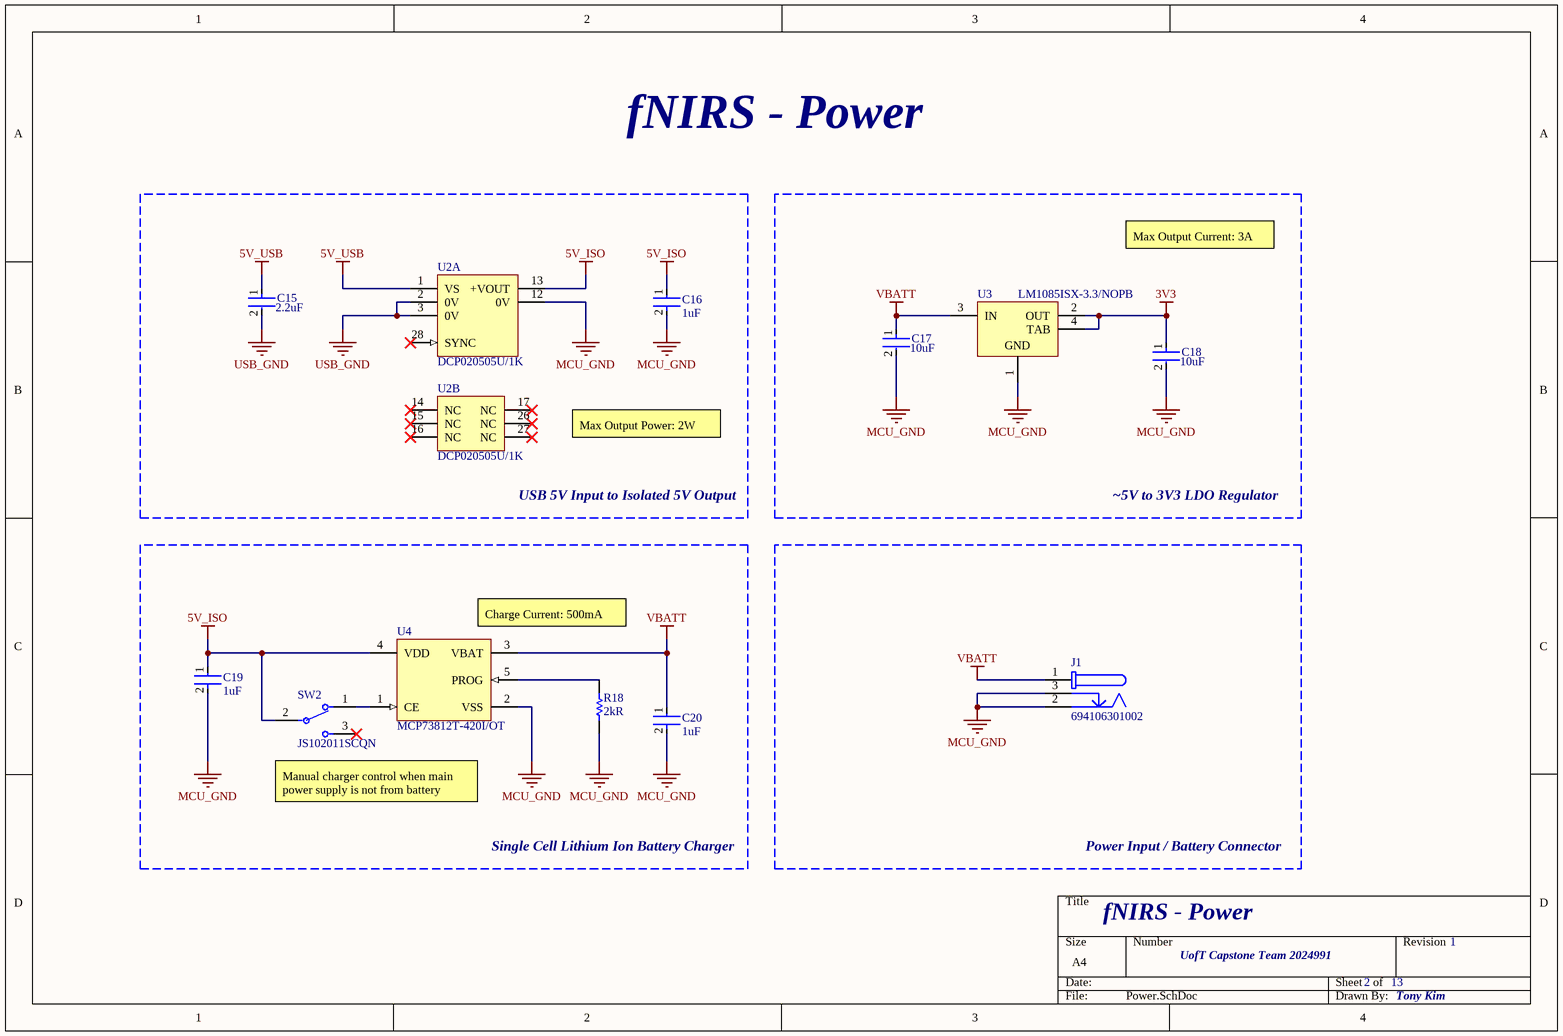
[diagram p6: Power.SchDoc]

### Parts
C15  Capacitance: 2.2uF  [FP-GRM188-0_1-e0_2_0_5-MFG]  (hidden comment: GRM188R61E225KA12D)
C16  Capacitance: 1uF  [FP-C1608-080-0_1-IPC_B]  (hidden comment: C1608X5R1H105K080AB)
C17  Capacitance: 10uF  [FP-GRM188-0_2-MFG]  (hidden comment: GRM188R61E106MA73D)
C18  Capacitance: 10uF  [FP-GRM188-0_2-MFG]  (hidden comment: GRM188R61E106MA73D)
C19  Capacitance: 1uF  [FP-C1608-080-0_1-IPC_B]  (hidden comment: C1608X5R1H105K080AB)
C20  Capacitance: 1uF  [FP-C1608-080-0_1-IPC_B]  (hidden comment: C1608X5R1H105K080AB)
J1  694106301002  [694106301002]
R18  Resistance: 2kR  [RESC1609X50X30ML10T20]  (hidden comment: CRCW06032K00FKEA)
SW2  JS102011SCQN  [FP-JS102011SCQN-MFG]
U2  DCP020505U/1K  [DVB0012A_L]  (parts A,B of 2)
U3  LM1085ISX-3.3/NOPB  [KTT0003B_M]
U4  MCP73812T-420I/OT  [SOT-23-OT5_M]

### Blocks framed on the sheet
USB 5V Input to Isolated 5V Output: C15 C16 U2
~5V to 3V3 LDO Regulator: C17 C18 U3
Single Cell Lithium Ion Battery Charger: C19 C20 R18 SW2 U4
Power Input / Battery Connector: J1

### Nets
3V3: C18.1 U3.2(OUT) U3.4(TAB)
5V_ISO: C16.1 C19.1 SW2.2(C) U2.13(+VOUT) U4.4(VDD)
5V_USB: C15.1 U2.1(VS)
MCU_GND: C16.2 C17.2 C18.2 C19.2 C20.2 J1.2 J1.3 R18.1 U2.12(0V) U3.1(GND) U4.2(VSS)
USB_GND: C15.2 U2.2(0V) U2.3(0V)
VBATT: C17.1 C20.1 J1.1 U3.3(IN) U4.3(VBAT)
NetR18_2: R18.2 U4.5(PROG)
NetSW2_1: SW2.1 U4.1(CE)

Not connected (* = marked no-connect by the designer): SW2 3*; U2 14(NC)* 15(NC)* 16(NC)* 17(NC)* 26(NC)* 27(NC)* 28(SYNC)*

### Notes on the sheet
- fNIRS - Power
- Max Output Current: 3A
- Max Output Power: 2W
- (near U4) Charge Current: 500mA
- (near SW2) Manual charger control when main power supply is not from battery

### Library data of the parts
C15 = CMP-2006-02820-2: Chip Multilayer Ceramic Capacitors for General Purpose, 0603, 2.2uF, X5R, 15%, 10%, 25V; Number of Pins: 2; Dielectric: X5R; Tolerance: 10%; Case Code (Imperial): 0603; Thickness: 0.035inch; Case/Package: 0603; Lead Free: Lead Free; Mount: Surface Mount; Material: Ceramic; Depth: 0.8mm; Voltage: 25V; Min Operating Temperature: -55°C; Package Quantity: 4000; REACH SVHC: No SVHC; Resistor Type: Ceramic; Packaging: Tape and Reel; Case Code (Metric): 1608; Max Operating Temperature: 85°C; Width: 0.8mm; Termination: SMD/SMT; Voltage Rating: 25V; Length: 1.6mm; Voltage Rating (DC): 25V; Height: 0.8mm; Radiation Hardening: No; Weight: 0.000222oz
C16 C19 C20 = CMP-2000-06025-2: Multilayer Ceramic Capacitors 1μF ±10% 50V X5R SMD 0603; Lead Free: Lead Free; Height: 0.8mm; Mount: Surface Mount; Radiation Hardening: No; Thickness: 0.035inch; Length: 1.6mm; Max Operating Temperature: 85°C; REACH SVHC: No SVHC; Min Operating Temperature: -55°C; Construction: Flat; RoHS Compliant: Yes; Voltage Rating: 50V; Dielectric: X5R; Packaging: Tape and Reel; Termination: SMD/SMT; Voltage Rating (DC): 50V; Case Code (Imperial): 0603; Voltage: 50V; Width: 0.031inch; Weight: 7.1E-05oz; Depth: 0.8mm; Case Code (Metric): 1608; Series: C; Case/Package: 0603; Tolerance: 10%; Resistor Type: Ceramic; Number of Pins: 2; Dielectric Material: Ceramic; Package Quantity: 1
C17 C18 = CMP-2006-02520-2: Chip Multilayer Ceramic Capacitors for General Purpose, 0603, 10uF, X5R, 15%, 20%, 25V; Tolerance: 20%; Resistor Type: Ceramic; Voltage: 25V; Max Operating Temperature: 85°C; Min Operating Temperature: -55°C; Dielectric: X5R; Lead Free: Lead Free; REACH SVHC: No SVHC; Case/Package: 0603; Mount: Surface Mount; Voltage Rating (DC): 25V; Height: 0.8mm; Length: 1.6mm; Thickness: 0.031inch; Width: 0.031inch; Termination: SMD/SMT; Case Code (Imperial): 0603; Case Code (Metric): 1608; Package Quantity: 1; Packaging: Tape and Reel; Depth: 0.8mm; Voltage Rating: 25V; Weight: 0.000222oz; Number of Pins: 2
J1 = CMP-1502-00188-2: NexarPartId: 52676100; Voltage Rating (DC): 20V; Gender: Male; Voltage Rating: 24V; Connector Type: Power; Insulation Resistance: 100MΩ; Current Rating: 5A; Shielding: Unshielded; Number of Contacts: 3; Color: Black; Housing Material: Polyamide; Contact Gender: Female; REACH SVHC: Unknown; Termination: Through Hole; Height: 11mm; RoHS: Compliant; Mount: Through Hole; Flammability Rating: UL94 V-0; Packaging: Bulk; Min Operating Temperature: -40°C; Contact Plating: Tin; Max Operating Temperature: 85°C; Operating Supply Voltage: 24V; Contact Material: Gold, Tin
R18 = CMP-2000-03159-1: Manufacturer: Vishay Dale; Part Number: CRCW06032K00FKEA
SW2 = CMP-10038-000023-1: SWITCH SLIDE SPDT 300MA 6V; Electrical Life: 5000Cycles; Actuator Type: Standard; Contact Resistance: 70mR; Actuator Material: Nylon; Max Voltage Rating (DC): 30V; Actuator Length: 2mm; Switch Function: On-On; Actuator Color: Black; Radiation Hardening: No; Throw Configuration: SPDT; Depth: 7.5mm; Case/Package: SMD/SMT; Package Quantity: 4000; Min Operating Temperature: -40°C; Length: 8.5mm; Current Rating: 300mA; Mount: Surface Mount; Voltage Rating (DC): 6V; RoHS Compliant: Yes; Orientation: Straight; Housing Material: Nylon; Contact Plating: Silver; Max Operating Temperature: 85°C; Packaging: Tape and Reel; Switch Travel: 2mm; Max Current Rating: 300mA; Contact Material: Copper Alloy; Series: JS; Termination: Gull Wing
U2 = CMP-0387-00170-2: Miniature, 2 W Isolated Unregulated DC-DC Converter, -40 to 85 degC, 12-pin SOP (DVB12), Pb-Free (RoHS); Manufacturer: Texas Instruments; SubFamily: 1 W & 2 W Miniature; Vin(Max)(V): 5.5; Iout(Max)(A): 0.4; Regulated Outputs(#): 1; Vout(Max)(V): 5.25; Vout(Min)(V): 4.75; Vin(Min)(V): 4.5; ComponentLink2URL: http://www.ti.com/general/docs/lit/getliterature.tsp?genericPartNumber=DCP020505&fileType=pdf; PackageReference: DVB0012A; Eco-Plan: Pb-Free (RoHS); ComponentLink4Description: URL Link1; ComponentLink2Description: Datasheet; ComponentLink1URL: http://www.ti.com/; ComponentLink3Description: Package Specification; Code_JEDEC: MS-013-AE; ComponentLink4URL: Samples URL:http://www.ti.com/product/dcp020505#samples; ComponentLink1Description: Manufacturer URL; DatasheetVersion: SBVS011K; PackageDescription: 12-Pin Plastic Small Outline, Body 17.9 x 7.5 mm; PartNumber: DCP020505U/1K; Mounting Technology: Surface Mount; PackageVersion: 4202104/B; ComponentLink3URL: http://www.ti.com/lit/ml/mpds106a/mpds106a.pdf
U3 = CMP-0062-00579-5: 3A Low Dropout Positive Regulators, 3-pin TO-263, Pb-Free; Manufacturer: Texas Instruments; PackageTopMarking: NSUZXYTTE#*LM1085*IS-3.3; PowerWise: N; High-Reliability: Y; CompType: LDO IC; PartNumber: LM1085ISX-3.3/NOPB; PinCount: 3; Code_JEDEC: MO-169-AA; ComponentLink1URL: http://www.ti.com/general/docs/lit/getliterature.tsp?genericPartNumber=LM1085&fileType=pdf; PackageReference: KTT0003B; PackageDescription: TO-263, Molded, .400 x .390 x .180in, 3 Lead, .1in Pitch, Surface Mount; ComponentLink1Description: Datasheet URL; RoHS: Y
U4 = CMP-0133-00141-1: Simple, Miniature Single-Cell, Fully Integrated Li-Ion/Li-Polymer Charge Management Controller, 4.2V, 5-Pin SOT-23, Industrial Temperature, Tape and Reel; PackageReference: SOT-23-OT5; PackageVersion: revBB, Aug-2009; PackageDescription: 5-Lead Plastic Small Outline Transistor (OT) [SOT-23]; Code_IPC: SOT23-5; DatasheetVersion: revB, Sep-2007